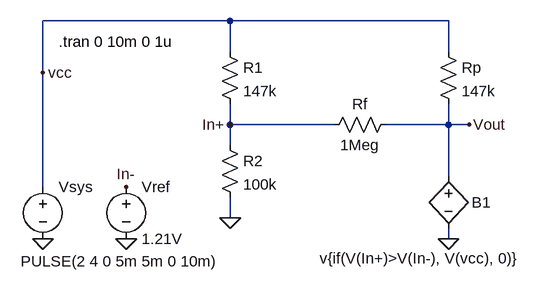
[diagram p0: schematic Comparator.asc]
Comparator.asc, the LTspice schematic file:
Version 4
SHEET 1 880 680
WIRE 48 -32 -240 -32
WIRE 384 -32 48 -32
WIRE 48 16 48 -32
WIRE 384 16 384 -32
WIRE -240 48 -240 -32
WIRE 48 128 48 96
WIRE 208 128 48 128
WIRE 384 128 384 96
WIRE 384 128 288 128
WIRE 416 128 384 128
WIRE 48 160 48 128
WIRE 384 208 384 128
WIRE -240 224 -240 48
WIRE 48 272 48 240
WIRE 384 304 384 288
FLAG -240 304 0
FLAG -240 48 vcc
FLAG 416 128 Vout
FLAG -112 224 In-
FLAG -112 304 0
FLAG 48 128 In+
FLAG 48 272 0
FLAG 384 304 0
SYMBOL voltage -240 208 R0
WINDOW 3 -34 131 Left 2
WINDOW 123 0 0 Left 0
WINDOW 39 0 0 Left 0
SYMATTR Value PULSE(2 4 0 5m 5m 0 10m)
SYMATTR InstName Vsys
SYMBOL res 368 0 R0
SYMATTR InstName Rp
SYMATTR Value 147k
SYMBOL voltage -112 208 R0
WINDOW 123 0 0 Left 0
WINDOW 39 0 0 Left 0
SYMATTR InstName Vref
SYMATTR Value 1.21V
SYMBOL bv 384 192 R0
WINDOW 0 36 56 Left 2
WINDOW 3 -198 142 Left 2
SYMATTR InstName B1
SYMATTR Value v{if(V(In+)>V(In-), V(vcc), 0)}
SYMBOL res 32 0 R0
SYMATTR InstName R1
SYMATTR Value 147k
SYMBOL res 32 144 R0
SYMATTR InstName R2
SYMATTR Value 100k
SYMBOL res 304 112 R90
WINDOW 0 0 56 VBottom 2
WINDOW 3 32 56 VTop 2
SYMATTR InstName Rf
SYMATTR Value 1Meg
TEXT -216 0 Left 2 !.tran 0 10m 0 1u

The netlist it stands for:
* Comparator.asc
Vsys vcc 0 PULSE(2 4 0 5m 5m 0 10m)
Rp vcc Vout 147k
Vref In- 0 1.21V
B1 Vout 0 v{if(V(In+)>V(In-), V(vcc), 0)}
R1 vcc In+ 147k
R2 In+ 0 100k
Rf Vout In+ 1Meg
.tran 0 10m 0 1u
.backanno
.end